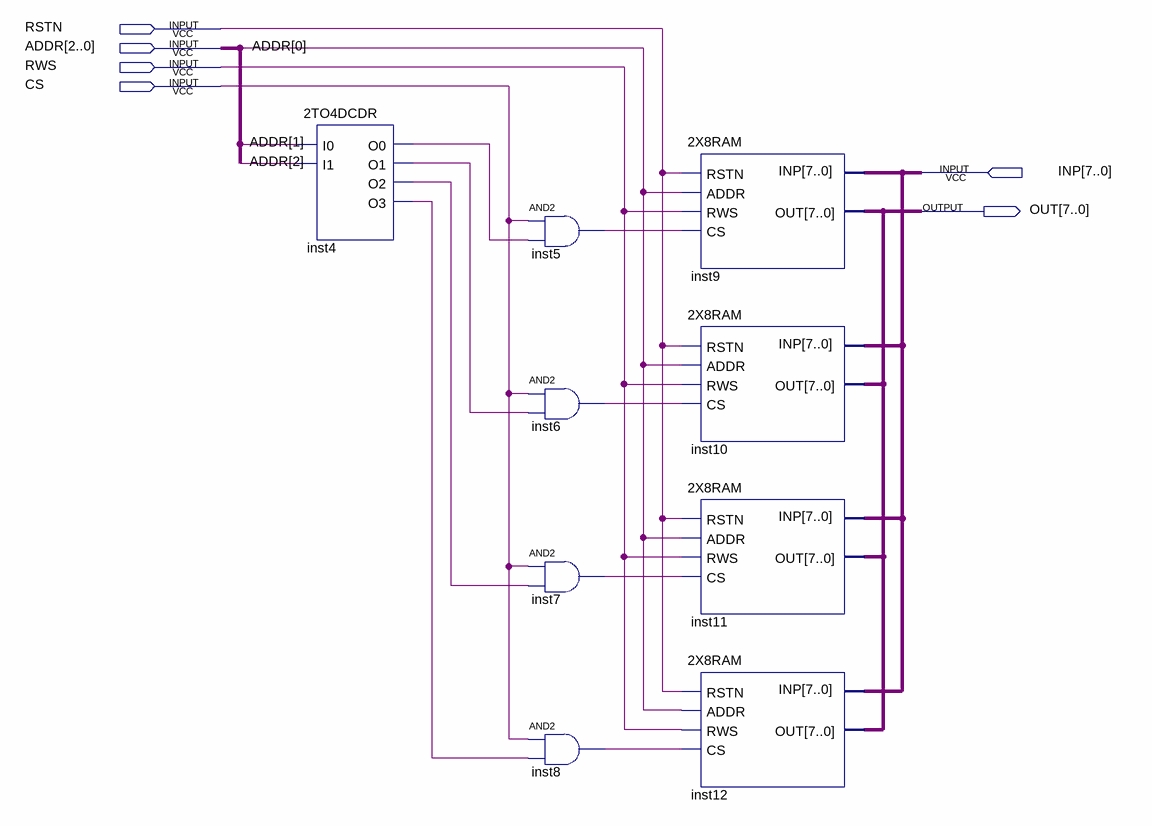
[diagram p0: schematic sheet]
// Quartus schematic 8X8RAM.bdf as structural Verilog: 9 symbols, 6 pins
module \8X8RAM  (
  input  RSTN,
  input  [2:0] ADDR,
  input  RWS,
  input  CS,
  input  [7:0] INP,
  output [7:0] OUT
);

  wire inst4_o0, inst4_o1, inst4_o2, inst4_o3, inst5_out, inst6_out, inst7_out, inst8_out;

  \2TO4DCDR  inst4 (.I0(ADDR[1]), .I1(ADDR[2]), .O0(inst4_o0), .O1(inst4_o1), .O2(inst4_o2), .O3(inst4_o3));
  and inst5 (inst5_out, CS, inst4_o0);
  and inst6 (inst6_out, CS, inst4_o1);
  and inst7 (inst7_out, CS, inst4_o2);
  and inst8 (inst8_out, CS, inst4_o3);
  \2X8RAM  inst9 (.RSTN(RSTN), .ADDR(ADDR[0]), .RWS(RWS), .CS(inst5_out), .INP(INP), .OUT(OUT));
  \2X8RAM  inst10 (.RSTN(RSTN), .ADDR(ADDR[0]), .RWS(RWS), .CS(inst6_out), .INP(INP), .OUT(OUT));
  \2X8RAM  inst11 (.RSTN(RSTN), .ADDR(ADDR[0]), .RWS(RWS), .CS(inst7_out), .INP(INP), .OUT(OUT));
  \2X8RAM  inst12 (.RSTN(RSTN), .ADDR(ADDR[0]), .RWS(RWS), .CS(inst8_out), .INP(INP), .OUT(OUT));
endmodule
